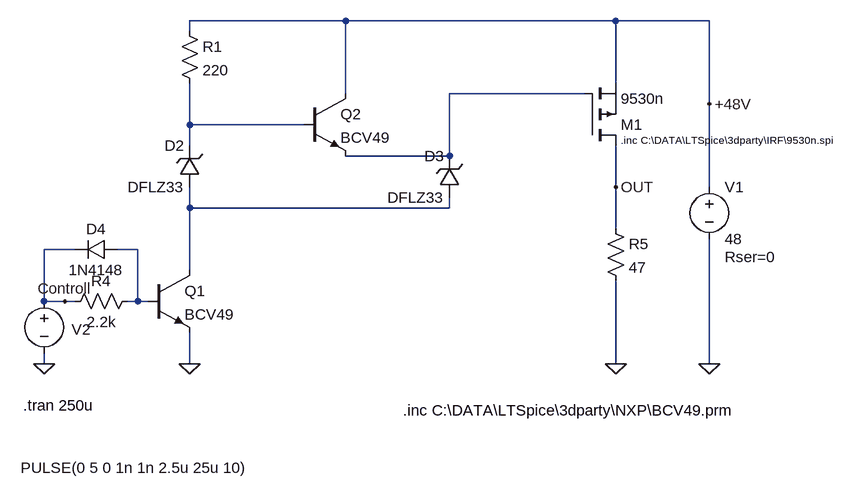
[diagram p0: schematic driver3.asc]
driver3.asc, the LTspice schematic file:
Version 4
SHEET 1 908 680
WIRE 96 -128 -144 -128
WIRE 512 -128 96 -128
WIRE 656 -128 512 -128
WIRE -144 -112 -144 -128
WIRE 512 -32 512 -128
WIRE 96 -16 96 -128
WIRE 464 -16 256 -16
WIRE 656 0 656 -128
WIRE -144 32 -144 -32
WIRE 32 32 -144 32
WIRE -144 64 -144 32
WIRE 256 80 256 -16
WIRE 256 80 96 80
WIRE 512 128 512 64
WIRE 656 128 656 0
WIRE -144 160 -144 128
WIRE 256 160 256 144
WIRE 256 160 -144 160
WIRE 512 192 512 128
WIRE -320 224 -368 224
WIRE -224 224 -256 224
WIRE -144 256 -144 160
WIRE -368 304 -368 224
WIRE -336 304 -368 304
WIRE -320 304 -336 304
WIRE -224 304 -224 224
WIRE -224 304 -240 304
WIRE -208 304 -224 304
WIRE -368 400 -368 384
WIRE -144 400 -144 352
WIRE 512 400 512 272
WIRE 656 400 656 208
FLAG 512 400 0
FLAG 656 400 0
FLAG -368 400 0
FLAG 656 0 +48V
FLAG -336 304 Controll
FLAG 512 128 OUT
FLAG -144 400 0
SYMBOL pmos 464 64 M180
SYMATTR InstName M1
SYMATTR Value 9530n
SYMATTR Prefix X
SYMBOL res -160 -128 R0
SYMATTR InstName R1
SYMATTR Value 220
SYMBOL res -224 288 R90
WINDOW 0 0 56 VBottom 2
WINDOW 3 32 56 VTop 2
SYMATTR InstName R4
SYMATTR Value 2.2k
SYMBOL res 496 176 R0
SYMATTR InstName R5
SYMATTR Value 47
SYMBOL voltage 656 112 R0
WINDOW 123 0 0 Left 2
WINDOW 39 24 124 Left 2
SYMATTR SpiceLine Rser=0
SYMATTR InstName V1
SYMATTR Value 48
SYMBOL voltage -368 288 R0
WINDOW 0 42 59 Left 2
WINDOW 3 -36 272 Left 2
WINDOW 123 0 0 Left 2
WINDOW 39 0 0 Left 2
SYMATTR InstName V2
SYMATTR Value PULSE(0 5 0 1n 1n 2.5u 25u 10)
SYMBOL zener -128 128 R180
WINDOW 0 24 64 Left 2
WINDOW 3 24 0 Left 2
SYMATTR InstName D2
SYMATTR Value DFLZ33
SYMBOL zener 272 144 R180
WINDOW 0 24 64 Left 2
WINDOW 3 24 0 Left 2
SYMATTR InstName D3
SYMATTR Value DFLZ33
SYMBOL npn 32 -16 R0
SYMATTR InstName Q2
SYMATTR Value BCV49
SYMATTR Prefix X
SYMBOL npn -208 256 R0
SYMATTR InstName Q1
SYMATTR Value BCV49
SYMATTR Prefix X
SYMBOL diode -256 208 R90
WINDOW 0 0 32 VBottom 2
WINDOW 3 32 32 VTop 2
SYMATTR InstName D4
SYMATTR Value 1N4148
TEXT 520 56 Left 1 !.inc C:\\DATA\\LTSpice\\3dparty\\IRF\\9530n.spi
TEXT -400 464 Left 2 !.tran 250u
TEXT 184 472 Left 2 !.inc C:\\DATA\\LTSpice\\3dparty\\NXP\\BCV49.prm

The netlist it stands for:
* driver3.asc
XM1 OUT N001 +48V 9530n  ; pins D G S
R1 +48V N002 220
R4 N004 Controll 2.2k
R5 OUT 0 47
V1 +48V 0 48 Rser=0
V2 Controll 0 PULSE(0 5 0 1n 1n 2.5u 25u 10)
D2 N003 N002 DFLZ33
D3 N003 N001 DFLZ33
XQ2 +48V N002 N001 BCV49  ; pins C B E
XQ1 N003 N004 0 BCV49  ; pins C B E
D4 N004 Controll 1N4148
.model D D
.lib standard.dio
.inc C:\DATA\LTSpice\3dparty\IRF\9530n.spi
.tran 250u
.inc C:\DATA\LTSpice\3dparty\NXP\BCV49.prm
.backanno
.end